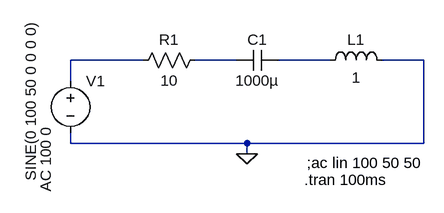
[diagram p0: schematic RLC Circuits (2) - Inductive Circuit.asc]
RLC Circuits (2) - Inductive Circuit.asc, the LTspice schematic file:
Version 4
SHEET 1 880 680
WIRE 48 96 -64 96
WIRE 192 96 128 96
WIRE 336 96 256 96
WIRE 480 96 416 96
WIRE -64 128 -64 96
WIRE -64 224 -64 208
WIRE 208 224 -64 224
WIRE 480 224 480 96
WIRE 480 224 208 224
WIRE 208 240 208 224
FLAG 208 240 0
SYMBOL voltage -64 112 R0
WINDOW 3 -61 -77 VRight 2
WINDOW 123 -38 87 VRight 2
WINDOW 39 0 0 Left 0
SYMATTR InstName V1
SYMATTR Value SINE(0 100 50 0 0 0 0)
SYMATTR Value2 AC 100 0
SYMBOL res 144 80 R90
WINDOW 0 0 56 VBottom 2
WINDOW 3 32 56 VTop 2
SYMATTR InstName R1
SYMATTR Value 10
SYMBOL cap 256 80 R90
WINDOW 0 0 32 VBottom 2
WINDOW 3 32 32 VTop 2
SYMATTR InstName C1
SYMATTR Value 1000µ
SYMBOL ind 320 112 R270
WINDOW 0 32 56 VTop 2
WINDOW 3 5 56 VBottom 2
SYMATTR InstName L1
SYMATTR Value 1
TEXT 300 254 Left 2 !;ac lin 100 50 50
TEXT 296 280 Left 2 !.tran 100ms

The netlist it stands for:
* RLC Circuits (2) - Inductive Circuit.asc
V1 N001 0 SINE(0 100 50 0 0 0 0) AC 100 0
R1 N002 N001 10
C1 N003 N002 1000µ
L1 N003 0 1
;ac lin 100 50 50
.tran 100ms
.backanno
.end